# Altium schematic sheet DesignProj.SchDoc
size A; SheetNumber: 1; SheetTotal: 1
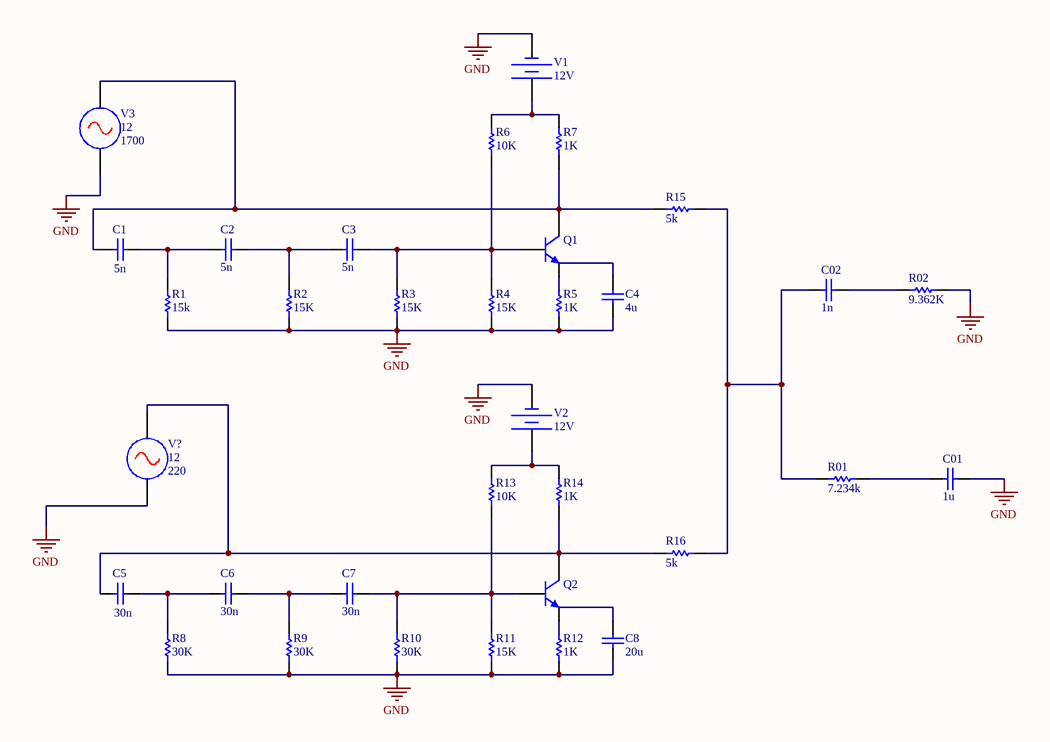
[diagram p0: DesignProj.SchDoc]

## Parts
C1  value 5n  (hidden comment: Capacitor)
C01  value 1u  (hidden comment: Capacitor)
C2  value 5n  (hidden comment: Capacitor)
C02  value 1n  (hidden comment: Capacitor)
C3  value 5n  (hidden comment: Capacitor)
C4  value 4u  (hidden comment: Capacitor)
C5  value 30n  (hidden comment: Capacitor)
C6  value 30n  (hidden comment: Capacitor)
C7  value 30n  (hidden comment: Capacitor)
C8  value 20u  (hidden comment: Capacitor)
Q1  Bipolar  NPN 3 Pins  Transistor VBIC Model  (value not drawn)
Q2  Bipolar  NPN 3 Pins  Transistor VBIC Model  (value not drawn)
R1  value 15k  (hidden comment: Resistor)
R01  value 7.234k  (hidden comment: Resistor)
R2  value 15K  (hidden comment: Resistor)
R02  value 9.362K  (hidden comment: Resistor)
R3  value 15K  (hidden comment: Resistor)
R4  value 15K  (hidden comment: Resistor)
R5  value 1K  (hidden comment: Resistor)
R6  value 10K  (hidden comment: Resistor)
R7  value 1K  (hidden comment: Resistor)
R8  value 30K  (hidden comment: Resistor)
R9  value 30K  (hidden comment: Resistor)
R10  value 30K  (hidden comment: Resistor)
R11  value 15K  (hidden comment: Resistor)
R12  value 1K  (hidden comment: Resistor)
R13  value 10K  (hidden comment: Resistor)
R14  value 1K  (hidden comment: Resistor)
R15  value 5k  (hidden comment: Resistor)
R16  value 5k  (hidden comment: Resistor)
V1  DC Magnitude: 12V  (hidden comment: Constant Voltage Source)
V2  DC Magnitude: 12V  (hidden comment: Constant Voltage Source)
V3  Amp: 12  Freq: 1700  (hidden comment: AC Voltage Source)
V?  Amp: 12  Freq: 220  (hidden comment: AC Voltage Source)

## Nets
GND: C01.2 C4.2 C8.2 R1.1 R2.1 R02.2 R3.1 R4.1 R5.1 R8.1 R9.1 R10.1 R11.1 R12.1 V1.2 V2.2 V3.2 V?.2
NetC1_1: C1.1 Q1.1(C) R7.1 R15.1 V3.1
NetC01_1: C01.1 R01.2
NetC1_2: C1.2 C2.1 R1.2
NetC02_1: C02.1 R01.1 R15.2 R16.2
NetC2_2: C2.2 C3.1 R2.2
NetC02_2: C02.2 R02.1
NetC3_2: C3.2 Q1.2(B) R3.2 R4.2 R6.1
NetC5_1: C5.1 Q2.1(C) R14.1 R16.1 V?.1
NetC5_2: C5.2 C6.1 R8.2
NetC6_2: C6.2 C7.1 R9.2
NetC7_2: C7.2 Q2.2(B) R10.2 R11.2 R13.1
NetQ1_3: Q1.3(E) R5.2
NetQ2_3: Q2.3(E) R12.2
NetR6_2: R6.2 R7.2 V1.1
NetR13_2: R13.2 R14.2 V2.1

Not connected (* = marked no-connect by the designer): C4 1; C8 1

## Library data of the parts
C1 C01 C2 C02-C8 = Capacitor: SimulationGenericComponent: True
Q1 Q2 = BJT NPN VBIC: SimulationGenericComponent: True; AFN: 1; AJC: -0.5; ART: 0.1; AVC1: 0; EA: 1.12; FC: 0.9; IBBE: 1e-06; IBCI: 1e-16; IBEI: 1e-18; MC: 0.33; NCN: 2; NKF: 0.5; PC: 0.75; TNOM: 27; VERS: 1.2; XII: 3; AJE: -0.5; AJS: -0.5; AVC2: 0; BFN: 1; CBCO: 0; CBEO: 0; CCSO: 0; CJC: 0; CJCP: 0; CJE: 0; CJEP: 0; CTH: 0; DEAR: 0; EAIC: 1.12; EAIE: 1.12; EAIS: 1.12; EANC: 1.12; EANE: 1.12; EANS: 1.12; EAP: 1.12; EBBE: 0; GAMM: 0; HRCF: 1; IBCIP: 0; IBCN: 0; IBCNP: 0; IBEIP: 0; IBEN: 0; IBENP: 0; IKF: 0; IKP: 0; IKR: 0; IS: 1e-16; ISP: 0; ISRR: 1; ITF: 0; KFN: 0; ME: 0.33; MS: 0.33; NBBE: 1; NCI: 1; NCIP: 1; NCNP: 2; NEI: 1; NEN: 2; NF: 1; NFP: 1; NR: 1; PE: 0.75; PS: 0.75; QBM: 0; QCO: 0; QTF: 0; RBI: 0.1; RBP: 0.1; RBX: 0; RCI: 0.1; RCX: 0; RE: 0; RS: 0; RTH: 0; TAVC: 0; TD: 0; TF: 0; TNBBE: 0; TNF: 0; TR: 0; TVBBE1: 0; TVBBE2: 0; VBBE: 0; VEF: 0; VER: 0; VO: 0; VREF: 0; VRT: 0; VTF: 0; WBE: 1; WSP: 1; XIKF: 0; XIN: 3; XIS: 3; XISR: 0; XRBI: 0; XRBP: 0; XRBX: 0; XRCI: 0; XRCX: 0; XRE: 0; XRS: 0; XTF: 0; XVO: 0
R1 R01 R2 R02-R16 = Resistor: TC1: 0; SimulationGenericComponent: True; TC2: 0
V1 V2 = Battery: SimulationGenericComponent: True
V3 V? = AC Voltage Source: SimulationGenericComponent: True; DC: 0; Phase: 0; Rser: 0; Cpar: 0